# EAGLE schematic EMF (EAGLE 9.2.1)
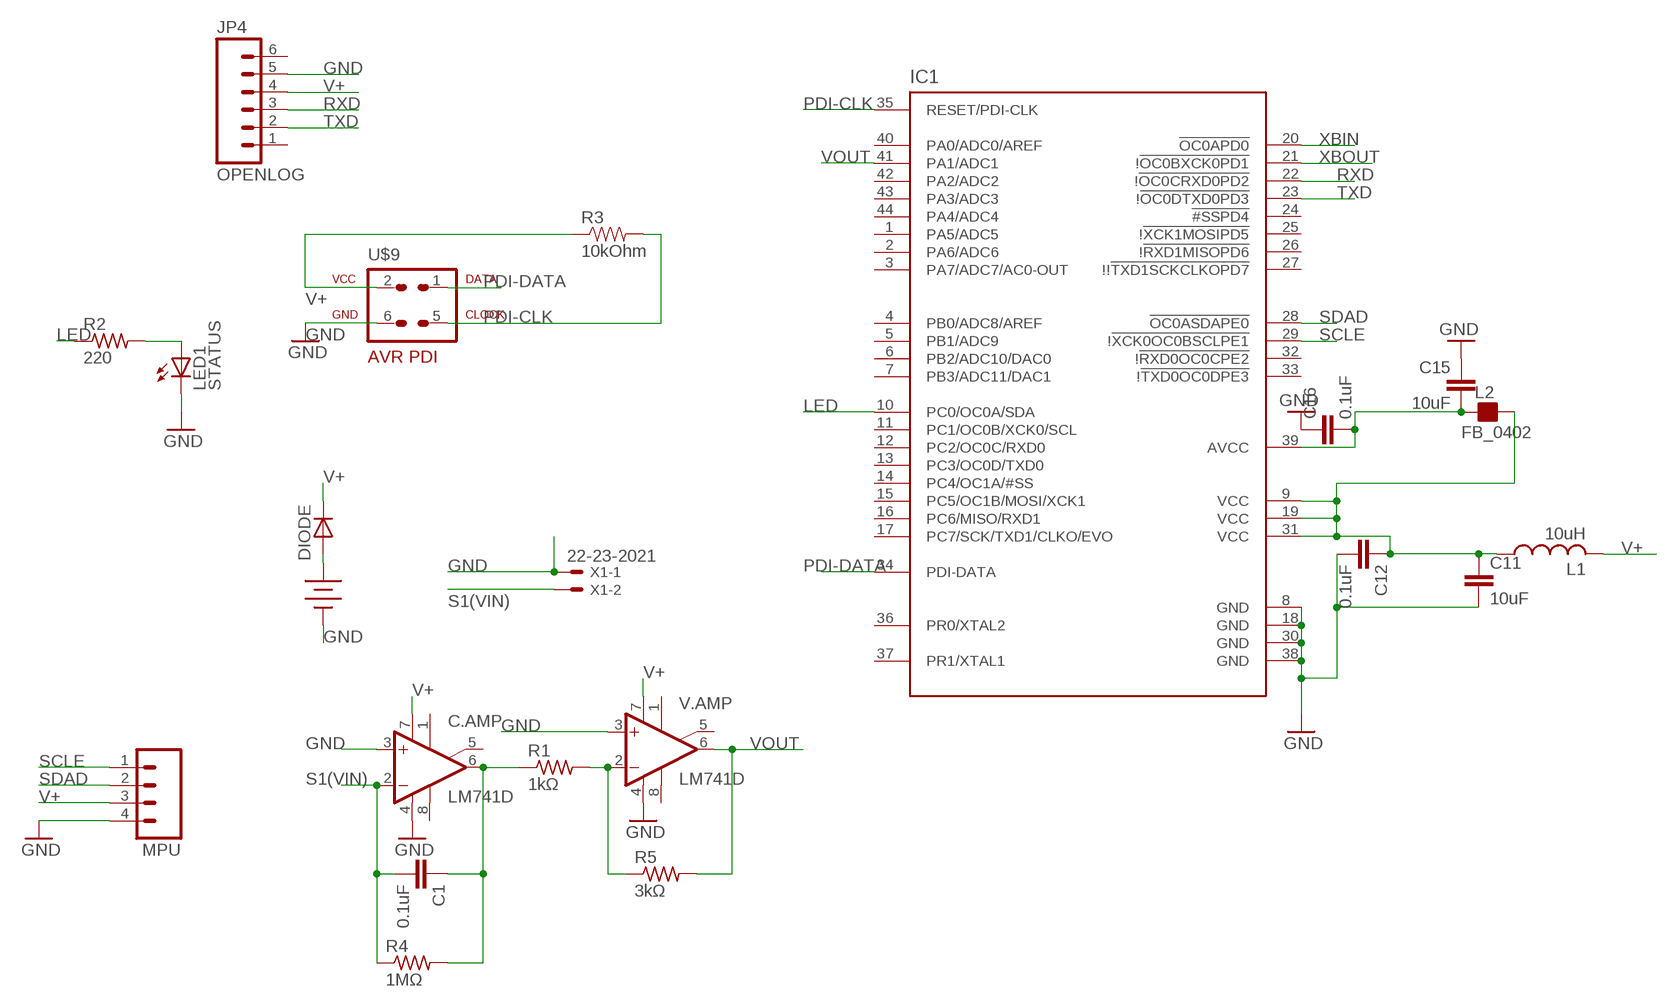
[diagram p0: schematic, sheet 1]

## Parts
C1  0.1uF  CAP0805  [0805]
C11  10uF  CAP0805  [0805]
C12  0.1uF  CAP0805  [0805]
C15  10uF  CAP0805  [0805]
C16  0.1uF  CAP0805  [0805]
C.AMP  LM741D  [SO08]
DIODE  LILYPAD-WEARABLES_LED1206  [LILYPAD-WEARABLES_LED-1206]
IC1  AT-XMEGA-XXA4-AU  [QFP80P1200X1200X120-44N]
JP4  OPENLOG  M06POLAR  [MOLEX-1X6]
L1  10uH  L-USL2012C  [L2012C]
L2  FB_0402  [L0402]
LED1  STATUS  LEDCHIP-LED0603  [CHIP-LED0603]
MPU  M04  [04P]
R1  1kΩ  R-US_M2012  [M2012]
R2  220  R-US_R0603  [R0603]
R3  10kOhm  RESISTOR0805-RES  [0805]
R4  1MΩ  R-US_M2012  [M2012]
R5  3kΩ  R-US_M2012  [M2012]
U$1  SHC_123_BATTERY_HOLDERCR-123-A  [SHC_CR-123-A_HOLDER]
U$9  AVR-PDIVERT  [AVR-ISP-6]
V.AMP  LM741D  [SO08]
X1  22-23-2021  [22-23-2021]

## Nets
GND: C11.2 C12.2 C15.1 C16.1 C.AMP.3(+IN) C.AMP.4(V-) IC1.8(GND) IC1.18(GND) IC1.30(GND) IC1.38(GND) JP4.5 LED1.C MPU.4 U$1.- U$9.6 V.AMP.3(+IN) V.AMP.4(V-) X1.1
LED: IC1.10(PC0/OC0A/SDA) R2.1
N$1: R1.2 R5.1 V.AMP.2(-IN)
N$2: DIODE.A U$1.+
N$3: C1.1 C.AMP.6(OUT) R1.1 R4.2
N$10: LED1.A R2.2
N$17: C15.2 C16.2 IC1.39(AVCC) L2.1
N$18: C11.1 C12.1 IC1.9(VCC) IC1.19(VCC) IC1.31(VCC) L1.1 L2.2
PDI-CLK: IC1.35(RESET/PDI-CLK) R3.2 U$9.5
PDI-DATA: IC1.34(PDI-DATA) U$9.1
RXD: IC1.22(!!OC0CRXD0PD2) JP4.3
S1(VIN): C1.2 C.AMP.2(-IN) R4.1 X1.2
SCLE: IC1.29(!!XCK0OC0BSCLPE1) MPU.1
SDAD: IC1.28(!OC0ASDAPE0) MPU.2
TXD: IC1.23(!!OC0DTXD0PD3) JP4.2
V+: C.AMP.7(V+) DIODE.C JP4.4 L1.2 MPU.3 R3.1 U$9.2 V.AMP.7(V+)
VOUT: IC1.41(PA1/ADC1) R5.2 V.AMP.6(OUT)
XBIN: IC1.20(!OC0APD0)
XBOUT: IC1.21(!!OC0BXCK0PD1)
Unconnected: C.AMP.1(ON1) C.AMP.5(ON2) C.AMP.8(OPT) IC1.1(PA5/ADC5) IC1.2(PA6/ADC6) IC1.3(PA7/ADC7/AC0-OUT) IC1.4(PB0/ADC8/AREF) IC1.5(PB1/ADC9) IC1.6(PB2/ADC10/DAC0) IC1.7(PB3/ADC11/DAC1) IC1.11(PC1/OC0B/XCK0/SCL) IC1.12(PC2/OC0C/RXD0) IC1.13(PC3/OC0D/TXD0) IC1.14(PC4/OC1A/#SS) IC1.15(PC5/OC1B/MOSI/XCK1) IC1.16(PC6/MISO/RXD1) IC1.17(PC7/SCK/TXD1/CLKO/EVO) IC1.24(!#SSPD4) IC1.25(!!XCK1MOSIPD5) IC1.26(!!RXD1MISOPD6) IC1.27(!!!TXD1SCKCLKOPD7) IC1.32(!!RXD0OC0CPE2) IC1.33(!!TXD0OC0DPE3) IC1.36(PR0/XTAL2) IC1.37(PR1/XTAL1) IC1.40(PA0/ADC0/AREF) IC1.42(PA2/ADC2) IC1.43(PA3/ADC3) IC1.44(PA4/ADC4) JP4.1 JP4.6 V.AMP.1(ON1) V.AMP.5(ON2) V.AMP.8(OPT)

## Library data of the parts
C1 C11 C12 C15 C16 = SparkFun:CAP: Capacitor Standard 0603 ceramic capacitor, and 0.1" leaded capacitor.
C.AMP = linear:*741: OP AMP
DIODE = Physoon:LILYPAD-WEARABLES_LED: LEDs Standard schematic elements and footprints for 5mm, 3mm, 1206, and 0603 sized LEDs. 5mm - Spark Fun Electronics SKU : Comp-SBL
IC1 = xmega-a4:AT-XMEGA-XXA4-AU: ATxMega a4 Serie
JP4 = SparkFun:M06: Header 6 Standard 6-pin 0.1" header. Use with straight break away headers (SKU : PRT-00116), right angle break away headers (PRT-00553), swiss pins (PRT-00743), machine pins (PRT-00117), and female headers (PRT-00115). Molex polarized connector foot print use with SKU : PRT-08094 with associated crimp pins and housings. NOTES ON THE VARIANTS LOCK and LOCK_LONGPADS... This footprint was designed to help hold the alignment of a through-hole component (i.e. 6-pin header) while soldering it into place. You may notice that each hole has been shifted either up or down by 0.005 of an inch from it's more standard position (which is a perfectly straight line). This slight alteration caused the pins (the squares in the middle) to touch the edges of the holes. Because they are alternating, it causes a "brace" to hold the component in place. 0.005 has proven to be the perfect amount of "off-center" position when using our standard breakaway headers. Although looks a little odd when you look at the bare footprint, once you have a header in there, the alteration is very hard to notice. Also, if you push a header all the way into place, it is covered up entirely on the bottom side. This idea of altering the position of holes to aid alignment will be further integrated into the Sparkfun Library for other footprints. It can help hold any component with 3 or more connection pins.
L1 = rcl:L-US: INDUCTOR, American symbol
L2 = rc-master-smd:FB_: FERRITE BEAD
LED1 = led:LED: LED OSRAM: - CHIPLED LG R971, LG N971, LY N971, LG Q971, LY Q971, LO R971, LY R971 LH N974, LH R974 LS Q976, LO Q976, LY Q976 LO Q996 - Hyper CHIPLED LW Q18S LB Q993, LB Q99A, LB R99A - SideLED LS A670, LO A670, LY A670, LG A670, LP A670 LB A673, LV A673, LT A673, LW A673 LH A674 LY A675 LS A676, LA A676, LO A676, LY A676, LW A676 LS A679, LY A679, LG A679 - Hyper Micro SIDELED® LS Y876, LA Y876, LO Y876, LY Y876 LT Y87S - SmartLED LW L88C, LW L88S LB L89C, LB L89S, LG L890 LS L89K, LO L89K, LY L89K LS L896, LA L896, LO L896, LY L896 - TOPLED LS T670, LO T670, LY T670, LG T670, LP T670 LSG T670, LSP T670, LSY T670, LOP T670, LYG T670 LG T671, LOG T671, LSG T671 LB T673, LV T673, LT T673, LW T673 LH T674 LS T676, LA T676, LO T676, LY T676, LB T676, LH T676, LSB T676, LW T676 LB T67C, LV T67C, LT T67C, LS T67K, LO T67K, LY T67K, LW E67C LS E67B, LA E67B, LO E67B, LY E67B, LB E67C, LV E67C, LT E67C LW T67C LS T679, LY T679, LG T679 LS T770, LO T770, LY T770, LG T770, LP T770 LB T773, LV T773, LT T773, LW T773 LH T774 LS E675, LA E675, LY E675, LS T675 LS T776, LA T776, LO T776, LY T776, LB T776 LHGB T686 LT T68C, LB T68C - Hyper Mini TOPLED® LB M676 - Mini TOPLED Santana® LG M470 LS M47K, LO M47K, LY M47K Source: http://www.osram.convergy.de LUXEON: - LUMILED® LXK2-PW12-R00, LXK2-PW12-S00, LXK2-PW14-U00, LXK2-PW14-V00 LXK2-PM12-R00, LXK2-PM12-S00, LXK2-PM14-U00 LXK2-PE12-Q00, LXK2-PE12-R00, LXK2-PE12-S00, LXK2-PE14-T00, LXK2-PE14-U00 LXK2-PB12-K00, LXK2-PB12-L00, LXK2-PB12-M00, LXK2-PB14-N00, LXK2-PB14-P00, LXK2-PB14-Q00 LXK2-PR12-L00, LXK2-PR12-M00, LXK2-PR14-Q00, LXK2-PR14-R00 LXK2-PD12-Q00, LXK2-PD12-R00, LXK2-PD12-S00 LXK2-PH12-R00, LXK2-PH12-S00 LXK2-PL12-P00, LXK2-PL12-Q00, LXK2-PL12-R00 Source: www.luxeon.com KINGBRIGHT: KA-3528ASYC Source: www.kingbright.com
MPU = con-amp-quick:M04: AMP QUICK CONNECTOR; OC_FARNELL: unknown; OC_NEWARK: unknown
R1 R2 R4 R5 = resistor:R-US_: RESISTOR, American symbol
R3 = SparkFun:RESISTOR: Resistor Basic schematic elements and footprints for 0603, 1206, and PTH resistors.
U$1 = EMF:SHC_123_BATTERY_HOLDER
U$9 = avr-7:AVR-PDI: AVR PDI programming interface connector
V.AMP = linear:*741: OP AMP; SPICEPREFIX: X
X1 = con-molex:22-23-2021: .100" (2.54mm) Center Header - 2 Pin; MF: MOLEX; MPN: 22-23-2021; OC_FARNELL: 1462926; OC_NEWARK: 25C3832